# Altium schematic sheet 1.POWER.SchDoc
size A4
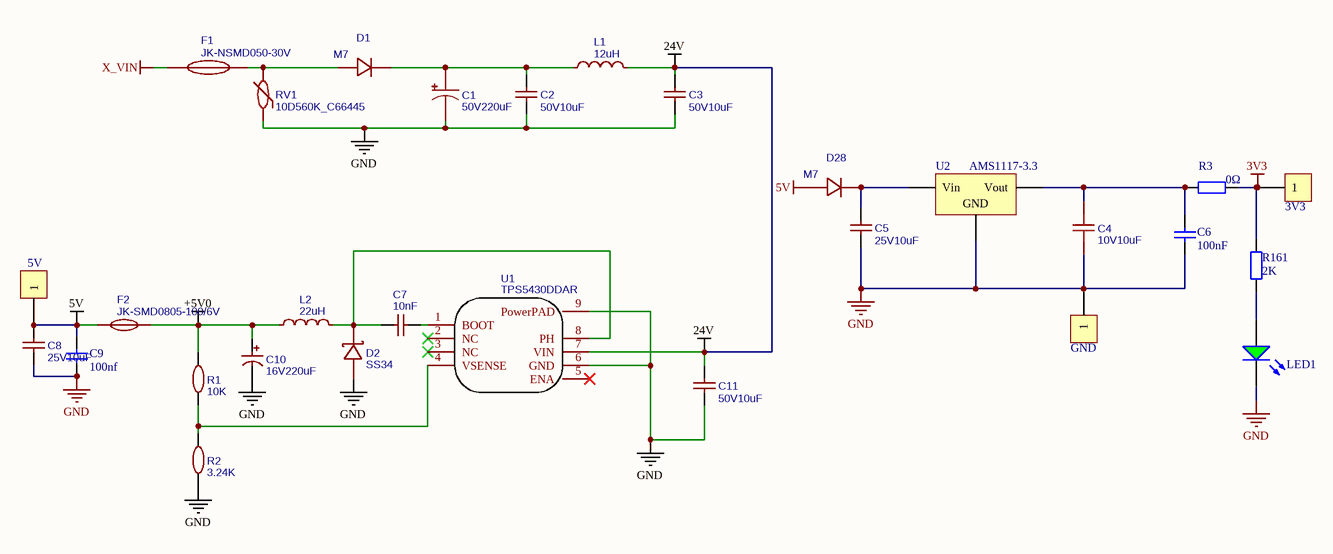
[diagram p0: 1.POWER.SchDoc]

## Parts
3V3  TST3V3  [Con-TEST-VCC]  (value not drawn)
5V  TST5V  [Con-TEST-VCC]  (value not drawn)
C1  50V220uF  [CAP-SMD_BD10.0-L10.3-W10.3-FD]
C2  50V10uF  [C1206]
C3  50V10uF  [C1206]
C4  10V10uF  [C0603-M]
C5  25V10uF  [C0805]
C6  100nF  [C0603-M]
C7  10nF  [C0603]
C8  25V10uF  [C0805]
C9  100nF  [C0603-M]
C10  16V220uF  [CAP-SMD_BD6.3-L6.6-W6.6-FD]
C11  50V10uF  [C1206]
D1  M7  [SMA_L4.4-W2.6-LS5.0-RD]
D2  SS34  [SMA_L4.3-W2.6-LS5.2-RD]
D28  M7  [SMA_L4.4-W2.6-LS5.0-RD]
F1  JK-NSMD050-30V  [F1206]
F2  JK-SMD0805-100/6V  [F0805]
GND  GND  [Con-TEST-VCC]  (value not drawn)
L1  12uH  [IND-SMD_L4.0-W4.0_SWPA4018S]
L2  22uH  [IND-SMD_L7.1-W6.6]
LED1  绿灯 0603  [0603_LED_S1]  (value not drawn)
R1  10K  [R0603]
R2  3.24K  [R0603]
R3  0Ω  [R0603-M]
R161  2K  [R0603-M]
RV1  10D560K_C66445  [RES-TH_L12.5-W4.0-P7.50-D1.0]
U1  TPS5430DDAR  [SOIC-8_L5.0-W4.0-P1.27-LS6.0-BL-EP2.0]
U2  AMS1117-3.3  [SOT-223]

## Nets
3V3: 3V3.1 R3.1 R161.2
5V: 5V.1 C8.2 C9.2 D28.2(A) F2.1
24V: C3.2 C11.2 L1.2 U1.7(VIN)
+5V0: C10.1 F2.2 L2.1 R1.2
GND: C1.2 C2.1 C3.1 C4.1 C5.1 C6.1 C8.1 C9.1 C10.2 C11.1 D2.2(A) GND.1 LED1.K R2.1 RV1.1 U1.6(GND) U1.9(PowerPAD) U2.1(GND)
X_VIN: F1.1
NetC1_1: C1.1 C2.2 D1.1(C) L1.1
NetC4_2: C4.2 C6.2 R3.2 U2.2(Vout)
NetC5_2: C5.2 D28.1(C) U2.3(Vin)
NetC7_1: C7.1 D2.1(K) L2.2 U1.8(PH)
NetC7_2: C7.2 U1.1(BOOT)
NetD1_2: D1.2(A) F1.2 RV1.2
NetLED1_A: LED1.A R161.1
NetR1_1: R1.1 R2.2 U1.4(VSENSE)

Not connected (* = marked no-connect by the designer): U1 2(NC)* 3(NC)* 5(ENA)*

## Library data of the parts
3V3 5V GND = CON1: Connector
C1 = 220uF: BOM_Manufacturer: Nichicon; BOM_Manufacturer Part: UWT1H221MNL1GS; nameAlias: Capacitance; Contributor: LCSC; BOM_Supplier: LCSC; BOM_Supplier Part: C125977; BOM_JLCPCB Part Class: Extended Part; spicePre: C; spiceSymbolName: UWT1H221MNL1GS
C2 C3 C11 = 10uF: 贴片电容; BOM_Manufacturer Part: CL31A106KBHNNNE; BOM_Manufacturer: SAMSUNG; nameAlias: Capacitance; BOM_Supplier: LCSC; BOM_Supplier Part: C13585; BOM_JLCPCB Part Class: Basic Part; spicePre: C; spiceSymbolName: CL31A106KBHNNNE
C4 = 10uF: 贴片电容; BOM_Manufacturer: SAMSUNG; BOM_Manufacturer Part: CL10A106KP8NNNC; nameAlias: Capacitance; BOM_Supplier: LCSC; BOM_Supplier Part: C19702; BOM_JLCPCB Part Class: Basic Part; spicePre: C; spiceSymbolName: CL10A106KP8NNNC
C5 C8 = 10uF: 贴片电容; BOM_Manufacturer Part: CL21A106KOQNNNE; BOM_Manufacturer: SAMSUNG; nameAlias: Capacitance; BOM_Supplier: LCSC; BOM_Supplier Part: C15850; BOM_JLCPCB Part Class: Extended Part; spicePre: C; spiceSymbolName: CL21A106KOQNNNE
C6 = Cap Semi: 贴片电容; Published: 8-Jun-2000; LatestRevisionDate: 17-Jul-2002; LatestRevisionNote: Re-released for DXP Platform.; PackageReference: C1206; Publisher: Altium Limited; Value: 100nF
C7 = 10nF: BOM_Manufacturer: FH; BOM_Manufacturer Part: 0603B103K500NT; nameAlias: Capacitance; BOM_Supplier: LCSC; BOM_Supplier Part: C57112; BOM_JLCPCB Part Class: Basic Part; spicePre: C; spiceSymbolName: 0603B103K500NT
C9 = Cap1: Capacitor; Published: 8-Jun-2000; Revision: July-2002: Re-released for DXP Platform.; Publisher: Altium Limited; Value: 100nf
C10 = 220uF: 贴片电解电容; BOM_Manufacturer: CapXon; BOM_Manufacturer Part: ZV221M016E077R; nameAlias: Capacitance; BOM_Supplier: LCSC; BOM_Supplier Part: C65226; BOM_JLCPCB Part Class: Extended Part; spicePre: C; spiceSymbolName: ZV221M016E077R
D1 D28 = M7_C426571: 通用二极管; BOM_Manufacturer: MDD; Contributor: LCSC; BOM_Supplier: LCSC; BOM_Supplier Part: C95872; BOM_Manufacturer Part: M7; BOM_JLCPCB Part Class: Extended Part; spicePre: D; spiceSymbolName: M7_C426571
D2 = B340A: 肖特基二极管; BOM_Manufacturer: MDD; BOM_Supplier: LCSC; BOM_Manufacturer Part: B340A; BOM_Supplier Part: C8678; BOM_JLCPCB Part Class: Extended Part; spicePre: D; spiceSymbolName: B340A
F1 = JK-NSMD050-30V: BOM_Manufacturer: Jinrui Electronic Materials Co.; Contributor: LCSC; BOM_Supplier: LCSC; BOM_Supplier Part: C720075; BOM_Manufacturer Part: JK-NSMD050-30V; BOM_JLCPCB Part Class: Extended Part; spicePre: F; spiceSymbolName: JK-NSMD050-30V
F2 = JK-SMD0805-100/6V: BOM_Manufacturer: JK(金科); Contributor: LCSC; BOM_Supplier: LCSC; BOM_Supplier Part: C2830233; BOM_Manufacturer Part: JK-SMD0805-100/6V; BOM_JLCPCB Part Class: Extended Part; spicePre: F; spiceSymbolName: JK-SMD0805-100/6V
L1 = 12uH: BOM_Manufacturer: Sunlord; BOM_Manufacturer Part: SWPA4030S120MT; nameAlias: Inductance; Contributor: LCSC; BOM_Supplier: LCSC; BOM_Supplier Part: C96892; BOM_JLCPCB Part Class: Extended Part; spicePre: L; spiceSymbolName: SWPA4030S120MT
L2 = 22uH: BOM_Manufacturer: YJYCOIN; BOM_Manufacturer Part: YSPI0630A-220M; nameAlias: Inductance; Contributor: LCSC; BOM_Supplier: LCSC; BOM_Supplier Part: C497873; BOM_JLCPCB Part Class: Extended Part; spicePre: L; spiceSymbolName: YSPI0630A-220M
LED1 = 0603 绿灯: 发光二极管; ComponentLink1Description: 供应商链接; ComponentLink1URL: http://www.szlcsc.com/product/details_73152.html; Package: 0603; Supplier: LC; SuppliersPartNumber: C72043; Value: 绿灯 0603
R1 = 10kΩ: BOM_Manufacturer: UniOhm; BOM_Manufacturer Part: 0603WAF1002T5E; nameAlias: Resistance; BOM_Supplier: LCSC; BOM_Supplier Part: C25804; Resistance (Ohms): 10K; BOM_JLCPCB Part Class: Basic Part; spicePre: R; spiceSymbolName: 0603WAF1002T5E
R2 = 3.24kΩ: BOM_Manufacturer: UniOhm; BOM_Manufacturer Part: 0603WAF3241T5E; nameAlias: Resistance; BOM_Supplier: LCSC; BOM_Supplier Part: C22994; Resistance (Ohms): 3.24K; BOM_JLCPCB Part Class: Extended Part; spicePre: R; spiceSymbolName: 0603WAF3241T5E
R3 = Res2: 贴片电阻/0Ω; Published: 8-Jun-2000; LatestRevisionDate: 17-Jul-2002; LatestRevisionNote: Re-released for DXP Platform.; PackageReference: AXIAL-0.4; Publisher: Altium Limited; Value: 0Ω
R161 = Res2: 贴片电阻; Published: 8-Jun-2000; LatestRevisionDate: 17-Jul-2002; LatestRevisionNote: Re-released for DXP Platform.; PackageReference: AXIAL-0.4; Publisher: Altium Limited; Value: 2K
RV1 = 10D560K_C66445: BOM_Manufacturer: RUILON; BOM_Supplier: LCSC; BOM_Manufacturer Part: 10D560K; BOM_Supplier Part: C66445; BOM_JLCPCB Part Class: Extended Part; spicePre: R; spiceSymbolName: 10D560K_C66445
U1 = TPS5430DDAR: BOM_Manufacturer: TI; SMT Type: Basic; Package Display: No; BOM_Supplier: LCSC; BOM_Manufacturer Part: TPS5430DDAR; BOM_LCSC Assembly: Yes; image: //image.lceda.cn/szlcsc/C9864.jpg; BOM_Supplier Part: C9864; spicePre: U; spiceSymbolName: TPS5430DDAR
U2 = SOT-223 AMS1117-3.3: 低压差线性稳压(LDO); ComponentLink1Description: 供应商链接; ComponentLink1URL: http://www.szlcsc.com/product/details_6652.html; Package: SOT-223; Supplier: LC; SuppliersPartNumber: C6186; Value: AMS1117-3.3